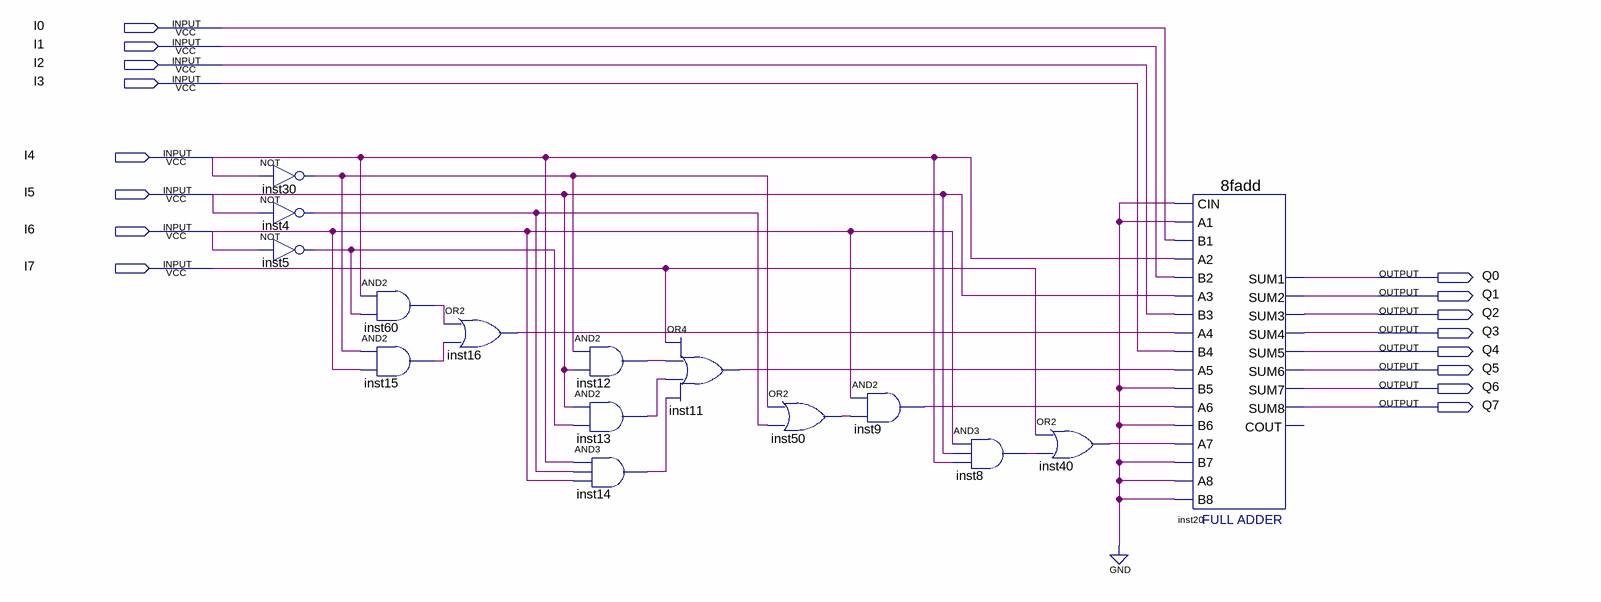
[diagram p0: schematic sheet]
// Quartus schematic bdc2bin.bdf as structural Verilog: 15 symbols, 16 pins
module bdc2bin (
  input  I0,
  input  I1,
  input  I2,
  input  I3,
  input  I4,
  input  I5,
  input  I6,
  input  I7,
  output Q0,
  output Q1,
  output Q2,
  output Q3,
  output Q4,
  output Q5,
  output Q6,
  output Q7
);

  wire inst4_out, inst5_out, inst8_out, inst9_out, inst11_out, inst12_out, inst13_out, inst14_out,
       inst15_out, inst16_out, inst30_out, inst40_out, inst50_out, inst60_out;

  not inst30 (inst30_out, I4);
  not inst4 (inst4_out, I5);
  not inst5 (inst5_out, I6);
  and inst60 (inst60_out, I4, inst5_out);
  and inst15 (inst15_out, inst30_out, I6);
  or inst16 (inst16_out, inst60_out, inst15_out);
  and inst12 (inst12_out, inst30_out, I5);
  and inst13 (inst13_out, I5, inst5_out);
  and inst14 (inst14_out, I4, inst4_out, I6);
  or inst11 (inst11_out, I7, inst12_out, inst13_out, inst14_out);
  or inst50 (inst50_out, inst30_out, inst4_out);
  and inst9 (inst9_out, I6, inst50_out);
  and inst8 (inst8_out, I6, I5, I4);
  or inst40 (inst40_out, I7, inst8_out);
  \8fadd  inst20 (
    .A1(1'b0), .A3(I5), .CIN(1'b0), .B1(I0), .A2(I4), .B2(I1), .A4(inst16_out), .B4(I3), .A5(inst11_out),
    .A7(inst40_out), .B6(1'b0), .B3(I2), .B8(1'b0), .B5(1'b0), .A6(inst9_out), .B7(1'b0), .A8(1'b0),
    .SUM2(Q1), .SUM5(Q4), .SUM6(Q5), .SUM1(Q0), .SUM3(Q2), .SUM4(Q3), .SUM7(Q6), .SUM8(Q7));  // open: COUT
endmodule
